# EasyEDA schematic PCB project_2020-06-05_12-44-14.json
TITLE: Sheet_1; REV: 1.0; Date: 2020-06-05; Sheet: 1/1; Drawn By: vermarah; Company: Your Company
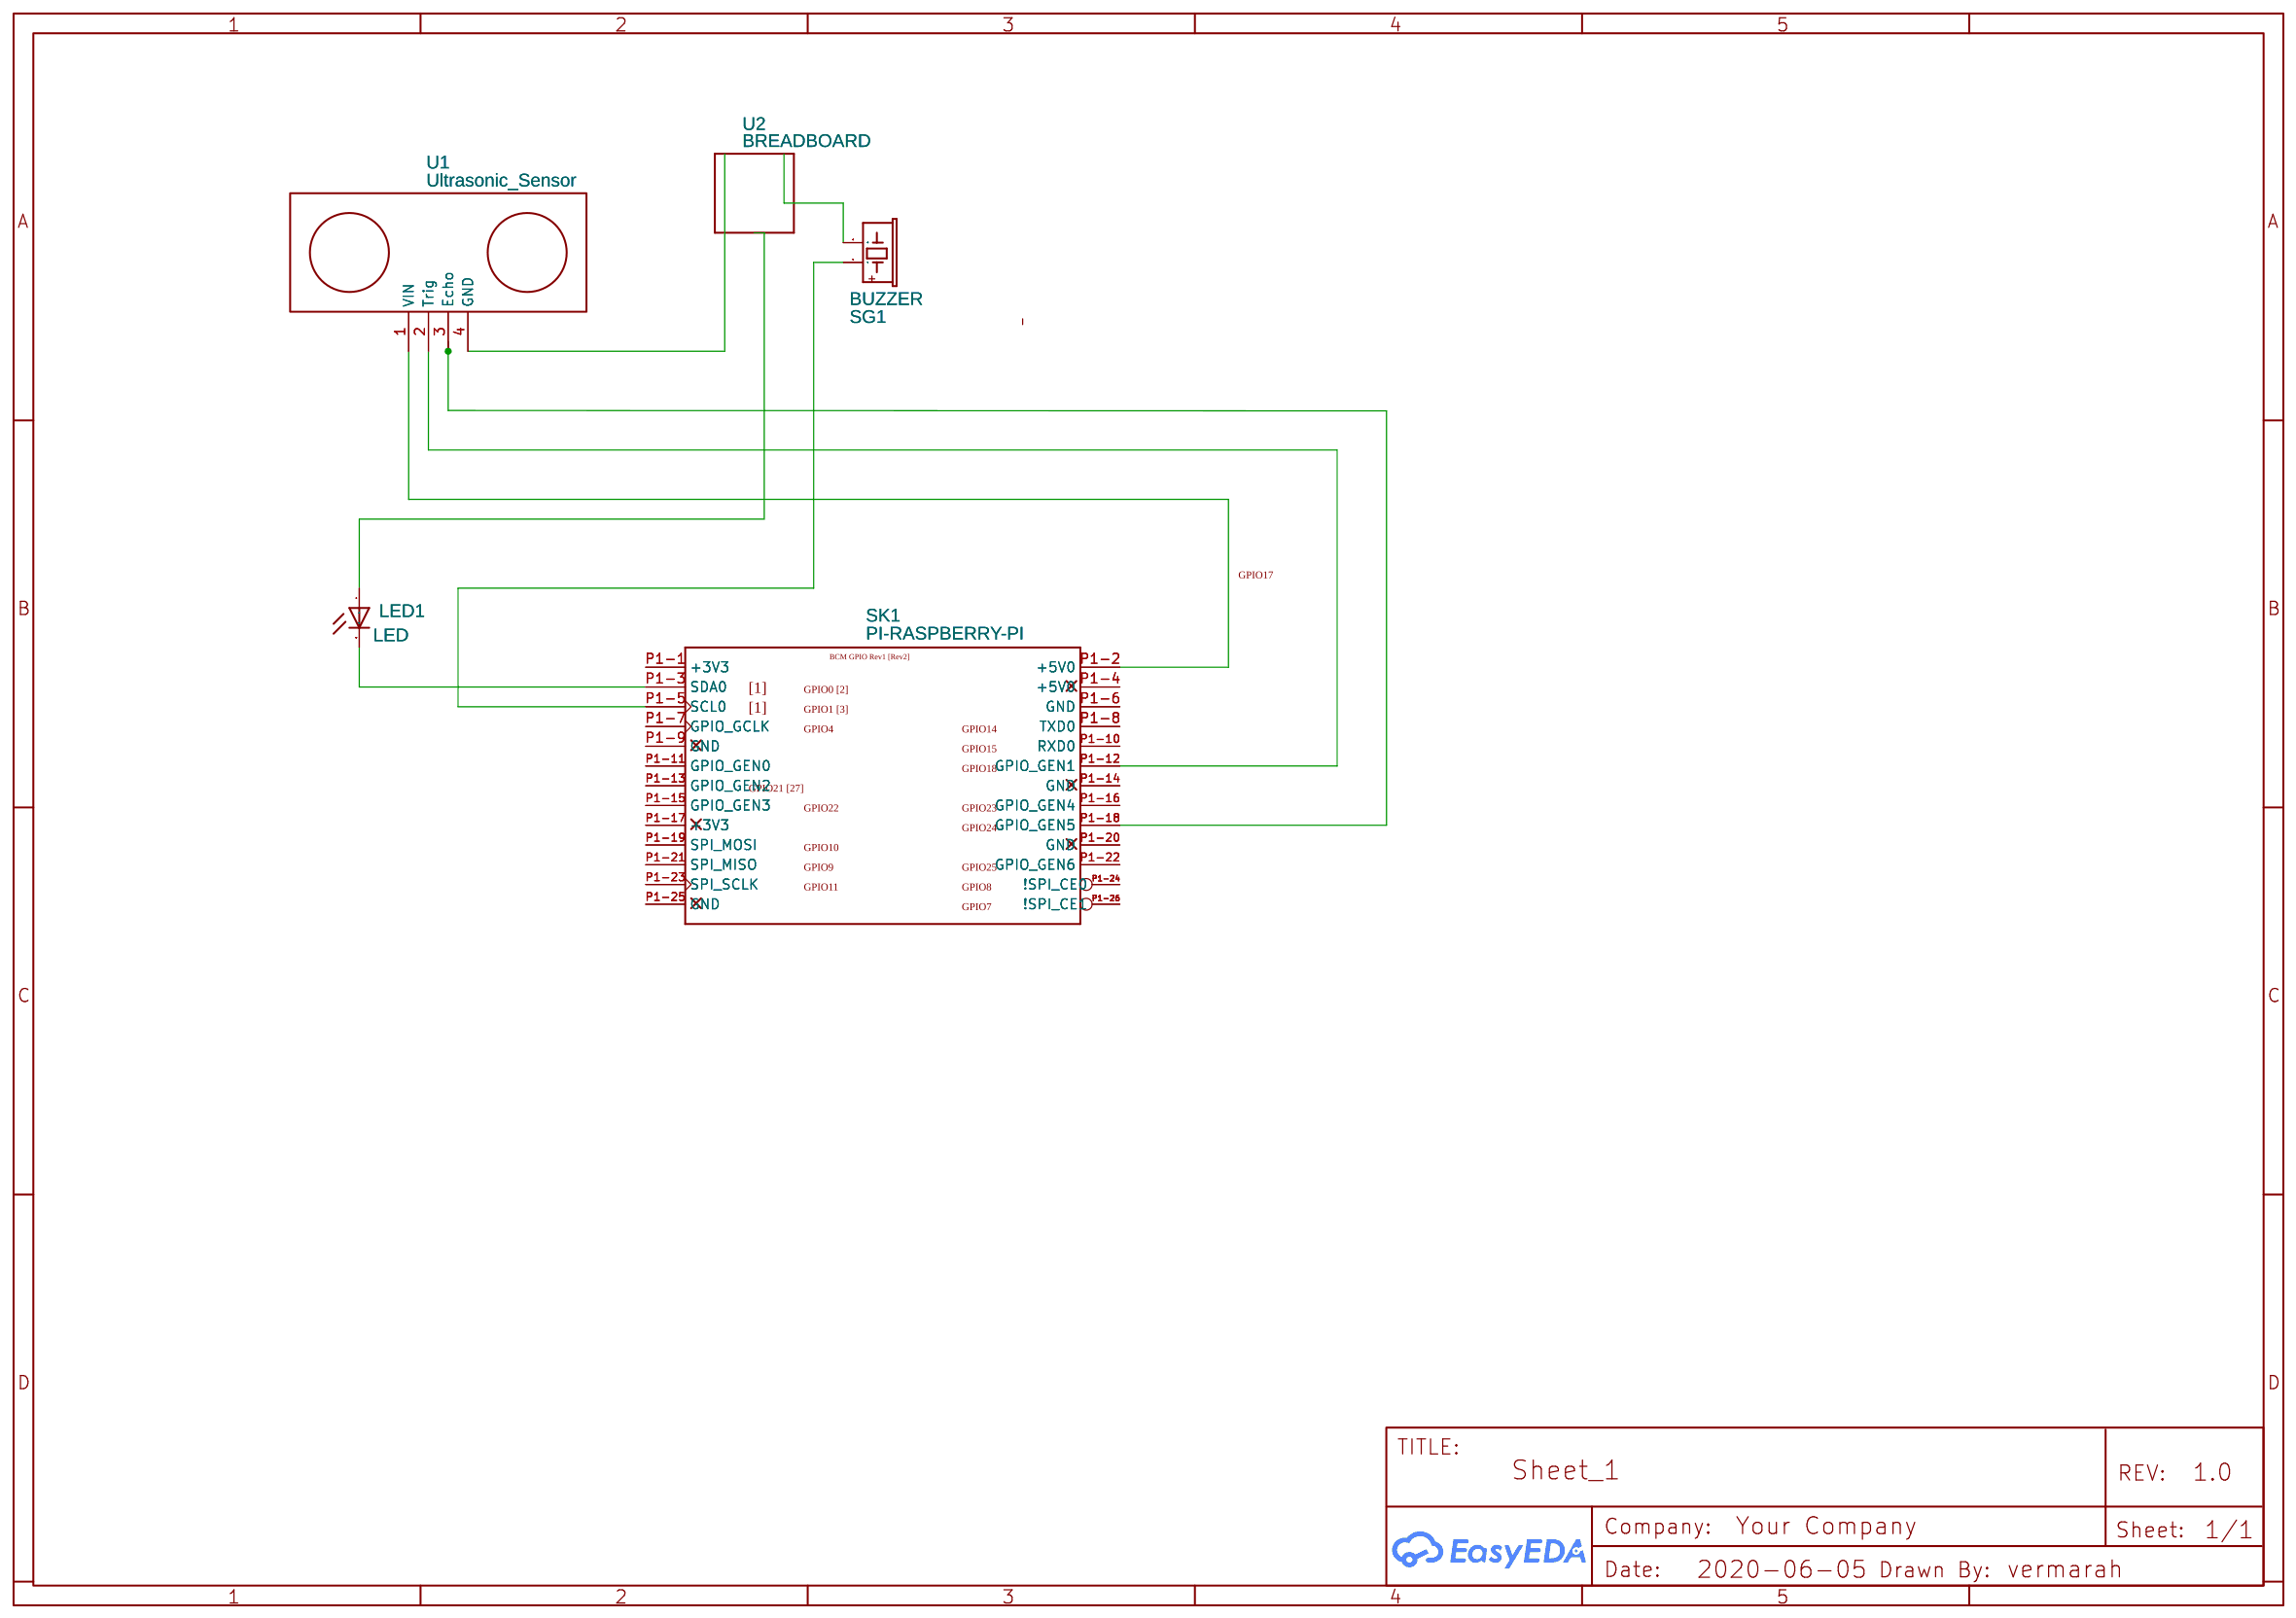
[diagram p0: schematic sheet]

## Parts
LED1  LED  [LED-603]
SG1  BUZZER  [BUZZER-HOFFMANN]
SK1  PI-RASPBERRY-PI  [RASPBERRY-PI]
U1  Ultrasonic_Sensor  [HC-SR04_]
U2  BREADBOARD  [BREADBOARD-MINI]

## Library data of the parts
LED1 = LED: Contributor: DangerousPrototype
SG1 = BUZZER: Contributor: SparkFun
SK1 = PI-RASPBERRY-PI
U1 = Ultrasonic_Sensor: Manufacturer Part: New SchematicLib; Contributor: mopeydodo
U2 = BREADBOARD: Contributor: SparkFun

## Nets
Net-(LED1-C): LED1.C SK1.P1-3(SDA0)
Net-(SG1-1): SG1.1 SK1.P1-5(SCL0)
Net-(SK1-P1-2): SK1.P1-2(+5V0) U1.1(VIN)
Net-(SK1-P1-12): SK1.P1-12(GPIO_GEN1) U1.2(Trig)
Net-(SK1-P1-18): SK1.P1-18(GPIO_GEN5) U1.3(Echo)

Not connected (* = marked no-connect by the designer): LED1 A; SG1 2; SK1 P1-1(+3V3) P1-4(+5V0) P1-6(GND) P1-7(GPIO_GCLK) P1-8(TXD0) P1-9(GND) P1-10(RXD0) P1-11(GPIO_GEN0) P1-13(GPIO_GEN2) P1-14(GND) P1-15(GPIO_GEN3) P1-16(GPIO_GEN4) P1-17(+3V3) P1-19(SPI_MOSI) P1-20(GND) P1-21(SPI_MISO) P1-22(GPIO_GEN6) P1-23(SPI_SCLK) P1-24(!SPI_CE0) P1-25(GND) P1-26(!SPI_CE1); U1 4(GND)
